# Altium schematic sheet D-Type Flip-Flop.SchDoc
size A4
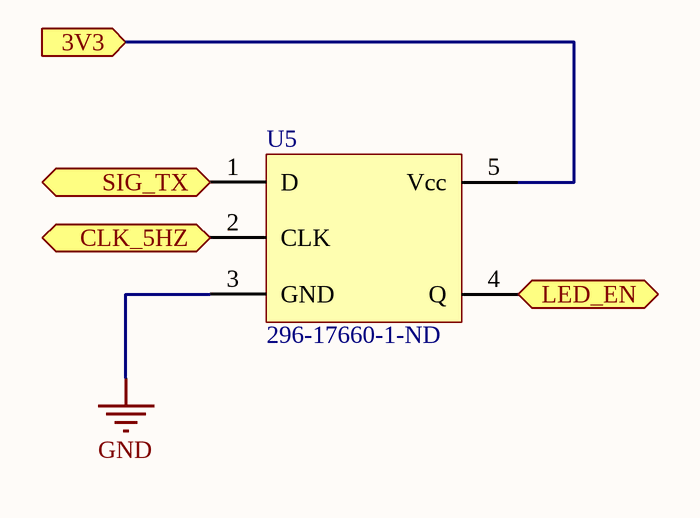
[diagram p0: D-Type Flip-Flop.SchDoc]

## Parts
U5  Supplier Part Number 1: 296-17660-1-ND  [SOT65P210X110-5N]  (hidden comment: SN74AUP1G79DCKR)

## Ports
3V3 (in), CLK_5HZ (in), LED_EN (out), SIG_TX (in)

## Nets
GND: U5.3(GND)
3V3: U5.5(Vcc) ; port 3V3
CLK_5HZ: U5.2(CLK) ; port CLK_5HZ
LED_EN: U5.4(Q) ; port LED_EN
SIG_TX: U5.1(D) ; port SIG_TX

## Library data of the parts
U5 = SN74AUP1G79DCKR: IC D-TYPE POS TRG SNGL SC70-5; Output Type: Non-Inverted; Number of Elements: 1; Clock Frequency: 266MHz; Max Propagation Delay @ V, Max CL: 5.8ns @ 3.3V, 30pF; Trigger Type: Positive Edge; Voltage - Supply: 0.8 V ~ 3.6 V; Current - Quiescent (Iq): 500nA; Input Capacitance: 1.5pF; Supplier 1: Digi-Key; Type: D-Type; Number of Bits per Element: 1; Operating Temperature: -40°C ~ 85°C (TA); Package / Case: 5-TSSOP, SC-70-5, SOT-353